# Altium schematic sheet Power_1.SchDoc
size A4; SheetNumber: 1; SheetTotal: 8
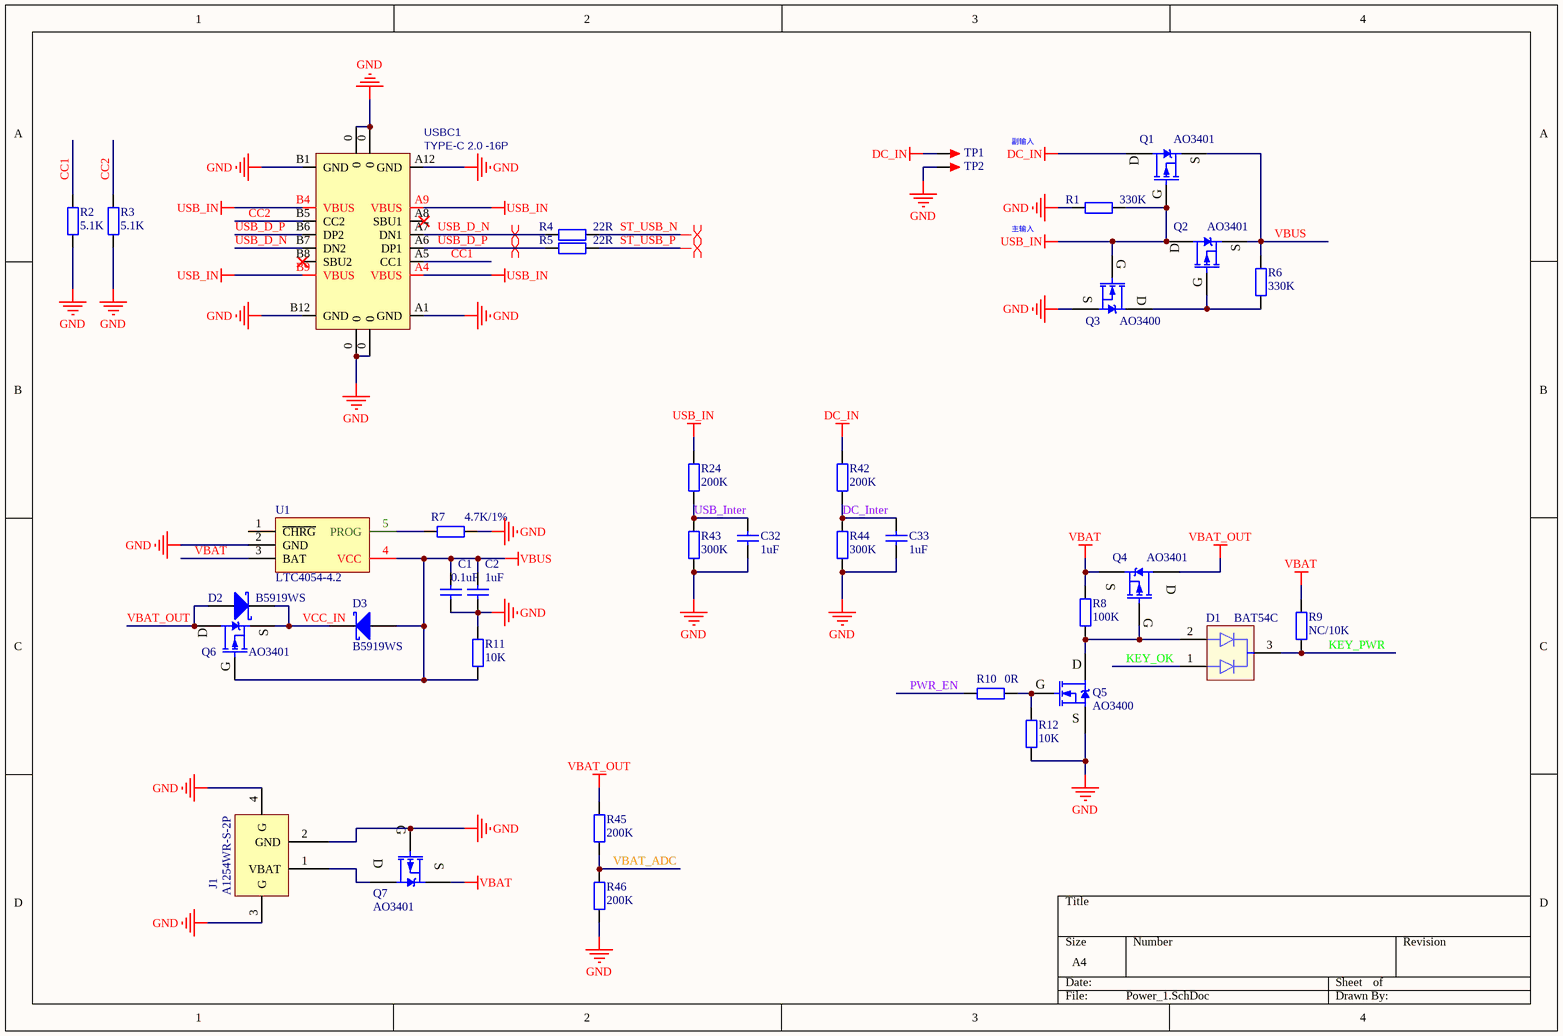
[diagram p0: Power_1.SchDoc]

## Parts
C1  0.1uF  [C0402_L]
C2  1uF  [C0402_L]
C32  1uF  [C0402_L]
C33  1uF  [C0402_L]
D1  BAT54C  [SOT23-3L]
D2  B5919WS  [SOD-123F]
D3  B5919WS  [SOD-123F]
J1  A1254WR-S-2P  [A1254WR-S-2P]
Q1  AO3401  [SOT23-3L]
Q2  AO3401  [SOT23-3L]
Q3  AO3400  [SOT23-3L]
Q4  AO3401  [SOT23-3L]
Q5  AO3400  [SOT23-3L]
Q6  AO3401  [SOT23-3L]
Q7  AO3401  [SOT23-3L]
R1  330K  [R0402_L]
R2  5.1K  [R0402_L]
R3  5.1K  [R0402_L]
R4  22R  [R0402_L]
R5  22R  [R0402_L]
R6  330K  [R0402_L]
R7  4.7K/1%  [R0402_L]
R8  100K  [R0402_L]
R9  NC/10K  [R0402_L]
R10  0R  [R0402_L]
R11  10K  [R0402_L]
R12  10K  [R0402_L]
R24  200K  [R0402_L]
R42  200K  [R0402_L]
R43  300K  [R0402_L]
R44  300K  [R0402_L]
R45  200K  [R0402_L]
R46  200K  [R0402_L]
TP1  TEST  [TEST 1]  (value not drawn)
TP2  TEST  [TEST 1]  (value not drawn)
U1  LTC4054-4.2  [SOT23-5L]
USBC1  TYPE-C 2.0 -16P  [USB-C-SMD_16P]

## Nets
DC_IN: Q1.3(D) R42.2 TP1.1
GND: C1.2 C2.2 C32.1 C33.1 J1.2(GND) J1.3(G) J1.4(G) Q3.2(S) Q5.2(S) Q7.1(G) R1.1 R2.1 R3.1 R7.2 R11.2 R12.2 R43.1 R44.1 R46.1 TP2.1 U1.2(GND) USBC1.0 USBC1.A1(GND) USBC1.A12(GND) USBC1.B1(GND) USBC1.B12(GND)
USB_IN: Q1.1(G) Q2.3(D) Q3.1(G) R1.2 R24.2 USBC1.A4(VBUS) USBC1.A9(VBUS) USBC1.B4(VBUS) USBC1.B9(VBUS)
VBAT: Q4.2(S) Q7.2(S) R8.2 R9.2 U1.3(BAT)
VBAT_OUT: D2.1(A) Q4.3(D) Q6.3(D) R45.2
VBUS: C1.1 C2.1 D3.1(A) Q1.2(S) Q2.2(S) Q6.1(G) R6.2 R11.1 U1.4(VCC)
CC1: R2.2 USBC1.A5(CC1)
CC2: R3.2 USBC1.B5(CC2)
DC_Inter: C33.2 R42.1 R44.2
KEY_OK: D1.1
KEY_PWR: D1.3 R9.1
PWR_EN: R10.2
ST_USB_N: R4.2
ST_USB_P: R5.2
USB_D_N: R4.1 USBC1.A7(DN1) USBC1.B7(DN2)
USB_D_P: R5.1 USBC1.A6(DP1) USBC1.B6(DP2)
USB_Inter: C32.2 R24.1 R43.2
VBAT_ADC: R45.1 R46.2
VCC_IN: D2.2(K) D3.2(K) Q6.2(S)
NetD1_2: D1.2 Q4.1(G) Q5.3(D) R8.1
NetJ1_1: J1.1(VBAT) Q7.3(D)
NetQ2_1: Q2.1(G) Q3.3(D) R6.1
NetQ5_1: Q5.1(G) R10.1 R12.1
NetR7_1: R7.1 U1.5(PROG)

Not connected (* = marked no-connect by the designer): U1 1(~{CHRG}); USBC1 A8(SBU1)* B8(SBU2)*

## Layout directives
differential pair: ST_USB_N, ST_USB_P, USB_D_N, USB_D_P

## Notes on the sheet
- 副输入
- 主输入

## Library data of the parts
C1 C2 C32 C33 = C: 贴片电容; BOM名称: 无极性贴片电容; 联系卖家，免费查找封装: 唯一出售店铺网址https://shop463601444.taobao.com
D1 = BAT54C: 共阴肖特基二极管
D2 D3 = 1N5819: 肖特基二极管; 联系卖家，免费查找封装: 唯一出售店铺网址https://shop463601444.taobao.com; BOM名称: 肖特基二极管
J1 = A1254WR-S-2P: 长江连接器-卧式-2P
Q1 Q2 Q4 Q6 Q7 = AO3401: P沟道 30V/4.2A; BOM名称: 场效应管; 联系卖家，免费查找封装: 唯一出售店铺网址https://shop463601444.taobao.com; 参数: P沟道 30V/4.2A
Q3 Q5 = AO3400: N沟道 30V/4.2A; BOM名称: 场效应管; 联系卖家，免费查找封装: 唯一出售店铺网址https://shop463601444.taobao.com; 参数: N沟道 30V/4.2A
R1-R12 R24 R42-R46 = R: 贴片电阻; 联系卖家，免费查找封装: 唯一出售店铺网址https://shop463601444.taobao.com; BOM名称: 贴片电阻
TP1 TP2 = TEST: 测试点; 联系卖家，免费查找封装: 唯一出售店铺网址https://shop463601444.taobao.com; 封装库来自淘宝卖家ID：黄晶宝石: 其他店铺购入均为盗版假冒封装库，请立即申请退款; BOM名称: 测试点
U1 = LTC4054-4.2: 锂电池充电IC
USBC1 = USB2.0_Type-C_16Pin: USB2.0_Type-C_16Pin母座; 联系卖家 免费查找封装: 唯一出售店铺网址https://shop463601444.taobao.com; 联系卖家 免费技术支持: 封装库来自淘宝卖家ID：黄晶宝石